# EAGLE design Y021 (EAGLE 6.6.0)

## Sheet 1 of 2
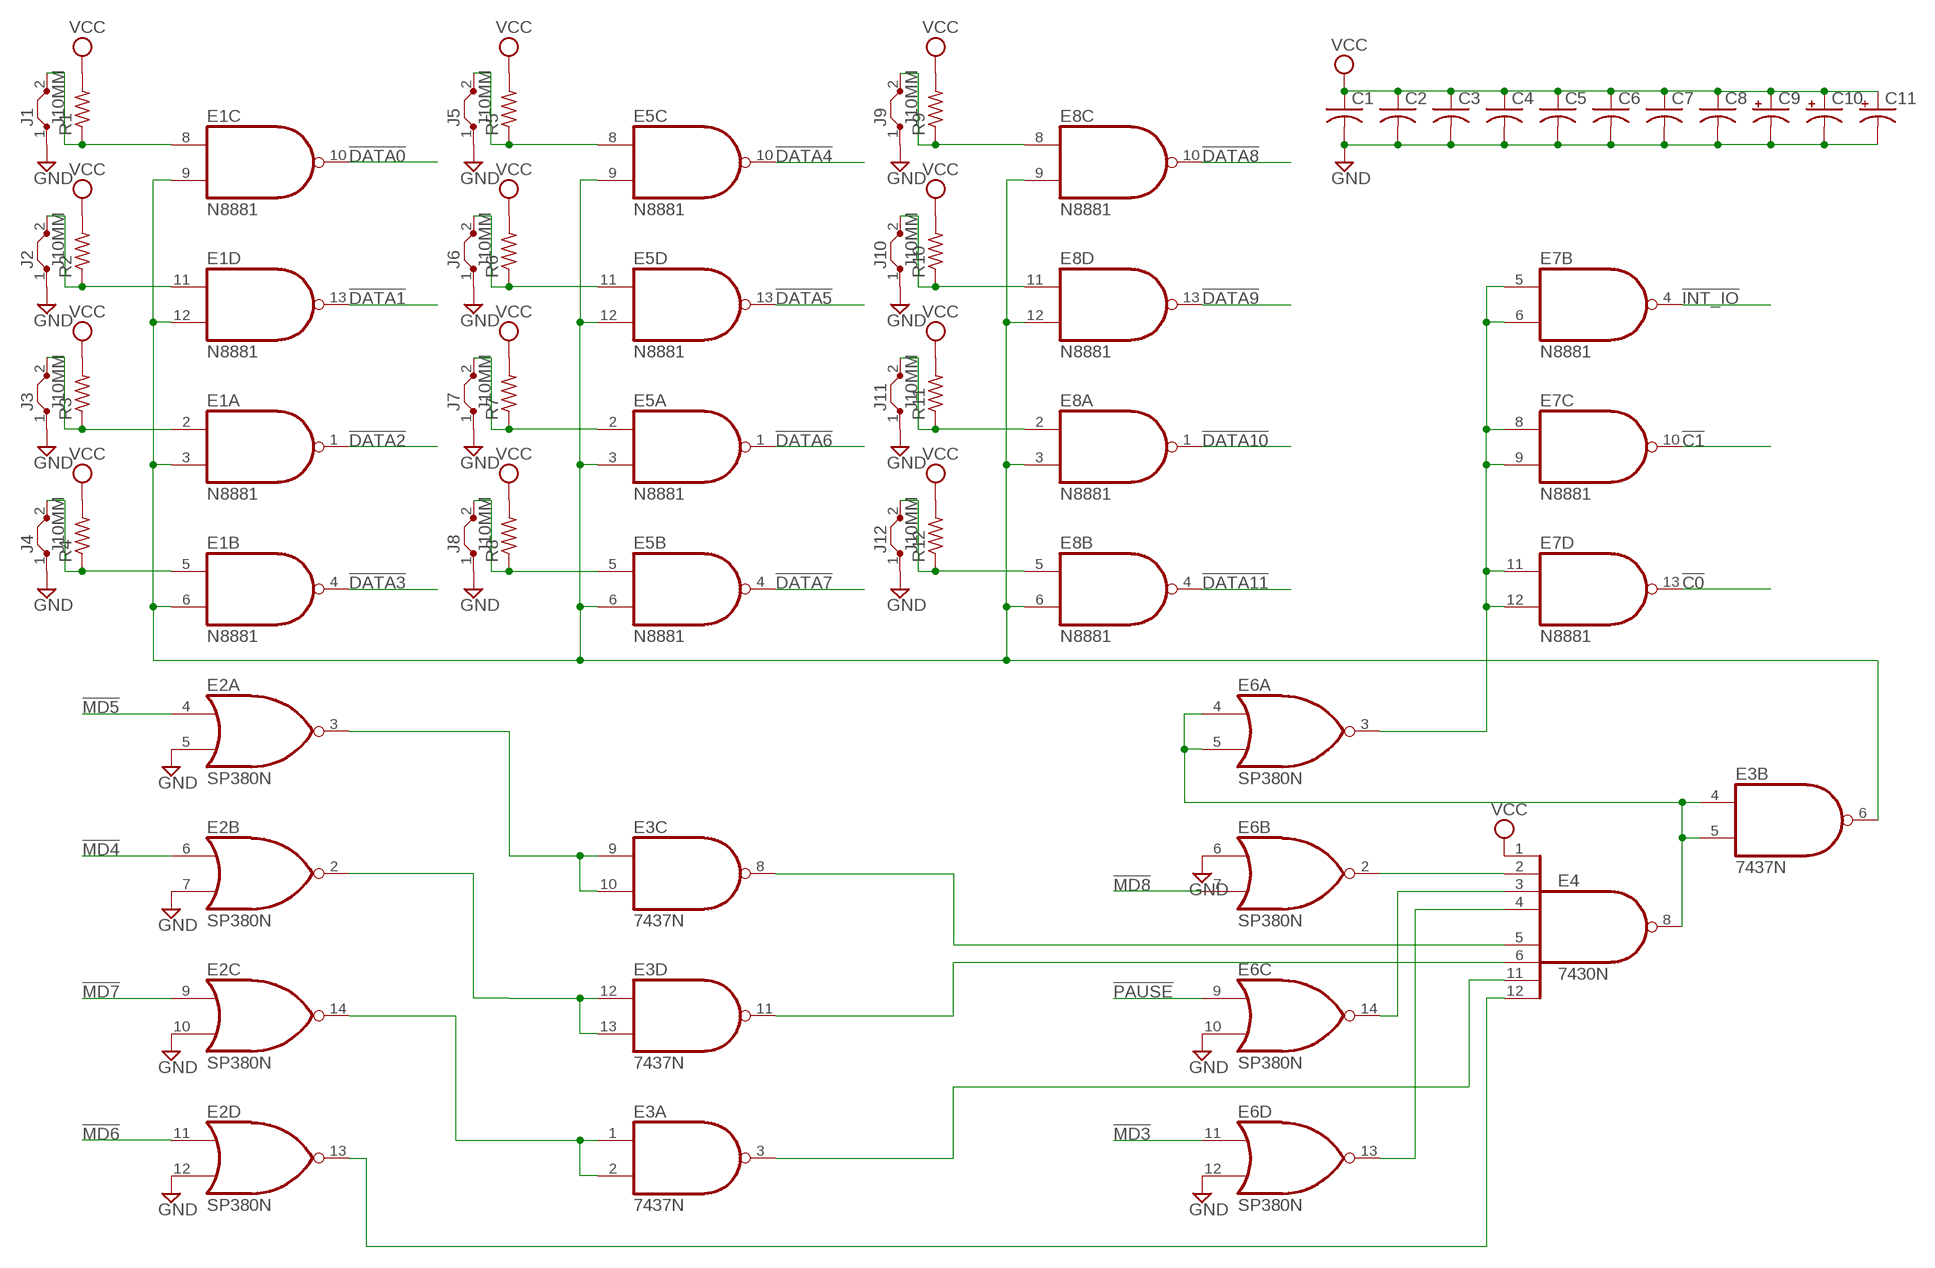
[diagram p0: schematic, sheet 1]

### Parts
C1  C-US050-025X075  [C050-025X075]
C2  C-US050-025X075  [C050-025X075]
C3  C-US050-025X075  [C050-025X075]
C4  C-US050-025X075  [C050-025X075]
C5  C-US050-025X075  [C050-025X075]
C6  C-US050-025X075  [C050-025X075]
C7  C-US050-025X075  [C050-025X075]
C8  C-US050-025X075  [C050-025X075]
C9  CPOL-USE22-6AXIAL  [E22-6]
C10  CPOL-USE22-6AXIAL  [E22-6]
C11  CPOL-USE22-6AXIAL  [E22-6]
E1  N8881  N8881N  [DIL14]
E2  SP380N  [DIL14]
E3  7437N  [DIL14]
E4  7430N  [DIL14]
E5  N8881  N8881N  [DIL14]
E6  SP380N  [DIL14]
E7  N8881  N8881N  [DIL14]
E8  N8881  N8881N  [DIL14]
J1  J10MM  [10]
J2  J10MM  [10]
J3  J10MM  [10]
J4  J10MM  [10]
J5  J10MM  [10]
J6  J10MM  [10]
J7  J10MM  [10]
J8  J10MM  [10]
J9  J10MM  [10]
J10  J10MM  [10]
J11  J10MM  [10]
J12  J10MM  [10]
R1  R-US_0207/10  [0207/10]
R2  R-US_0207/10  [0207/10]
R3  R-US_0207/10  [0207/10]
R4  R-US_0207/10  [0207/10]
R5  R-US_0207/10  [0207/10]
R6  R-US_0207/10  [0207/10]
R7  R-US_0207/10  [0207/10]
R8  R-US_0207/10  [0207/10]
R9  R-US_0207/10  [0207/10]
R10  R-US_0207/10  [0207/10]
R11  R-US_0207/10  [0207/10]
R12  R-US_0207/10  [0207/10]

### Nets
!C0: E7.13(D:O) ; also sheet 2
!C1: E7.10(C:O) ; also sheet 2
!DATA0: E1.10(C:O) ; also sheet 2
!DATA1: E1.13(D:O) ; also sheet 2
!DATA2: E1.1(A:O) ; also sheet 2
!DATA3: E1.4(B:O) ; also sheet 2
!DATA4: E5.10(C:O) ; also sheet 2
!DATA5: E5.13(D:O) ; also sheet 2
!DATA6: E5.1(A:O) ; also sheet 2
!DATA7: E5.4(B:O) ; also sheet 2
!DATA8: E8.10(C:O) ; also sheet 2
!DATA9: E8.13(D:O) ; also sheet 2
!DATA10: E8.1(A:O) ; also sheet 2
!DATA11: E8.4(B:O) ; also sheet 2
!INT_IO: E7.4(B:O) ; also sheet 2
!MD3: E6.11(D:I0) ; also sheet 2
!MD4: E2.6(B:I0) ; also sheet 2
!MD5: E2.4(A:I0) ; also sheet 2
!MD6: E2.11(D:I0) ; also sheet 2
!MD7: E2.9(C:I0) ; also sheet 2
!MD8: E6.7(B:I1) ; also sheet 2
!PAUSE: E6.9(C:I0) ; also sheet 2
GND [power]: C1.2 C2.2 C3.2 C4.2 C5.2 C6.2 C7.2 C8.2 C9.- C10.- C11.- E2.5(A:I1) E2.7(B:I1) E2.10(C:I1) E2.12(D:I1) E6.6(B:I0) E6.10(C:I1) E6.12(D:I1) J1.1 J2.1 J3.1 J4.1 J5.1 J6.1 J7.1 J8.1 J9.1 J10.1 J11.1 J12.1 ; also sheet 2
N$1: E1.2(A:I0) J3.2 R3.1
N$2: E1.3(A:I1) E1.6(B:I1) E1.9(C:I1) E1.12(D:I1) E3.6(B:O) E5.3(A:I1) E5.6(B:I1) E5.9(C:I1) E5.12(D:I1) E8.3(A:I1) E8.6(B:I1) E8.9(C:I1) E8.12(D:I1)
N$3: E1.11(D:I0) J2.2 R2.1
N$4: E6.3(A:O) E7.5(B:I0) E7.6(B:I1) E7.8(C:I0) E7.9(C:I1) E7.11(D:I0) E7.12(D:I1)
N$5: E1.8(C:I0) J1.2 R1.1
N$6: E5.2(A:I0) J7.2 R7.1
N$7: E1.5(B:I0) J4.2 R4.1
N$8: E5.8(C:I0) J5.2 R5.1
N$9: E5.11(D:I0) J6.2 R6.1
N$10: E5.5(B:I0) J8.2 R8.1
N$11: E8.8(C:I0) J9.2 R9.1
N$12: E8.5(B:I0) J12.2 R12.1
N$13: E8.2(A:I0) J11.2 R11.1
N$14: E8.11(D:I0) J10.2 R10.1
N$15: E4.2(I1) E6.2(B:O)
N$16: E4.3(I2) E6.14(C:O)
N$17: E3.4(B:I0) E3.5(B:I1) E4.8(O) E6.4(A:I0) E6.5(A:I1)
N$18: E4.4(I3) E6.13(D:O)
N$19: E3.8(C:O) E4.5(I4)
N$20: E3.11(D:O) E4.6(I5)
N$21: E2.13(D:O) E4.12(I7)
N$22: E3.3(A:O) E4.11(I6)
N$24: E2.3(A:O) E3.9(C:I0) E3.10(C:I1)
N$25: E2.2(B:O) E3.12(D:I0) E3.13(D:I1)
N$26: E2.14(C:O) E3.1(A:I0) E3.2(A:I1)
VCC [power]: C1.1 C2.1 C3.1 C4.1 C5.1 C6.1 C7.1 C8.1 C9.+ C10.+ C11.+ E4.1(I0) R1.2 R2.2 R3.2 R4.2 R5.2 R6.2 R7.2 R8.2 R9.2 R10.2 R11.2 R12.2 ; also sheet 2
Unconnected: E7.1(A:O) E7.2(A:I0) E7.3(A:I1)

## Sheet 2 of 2
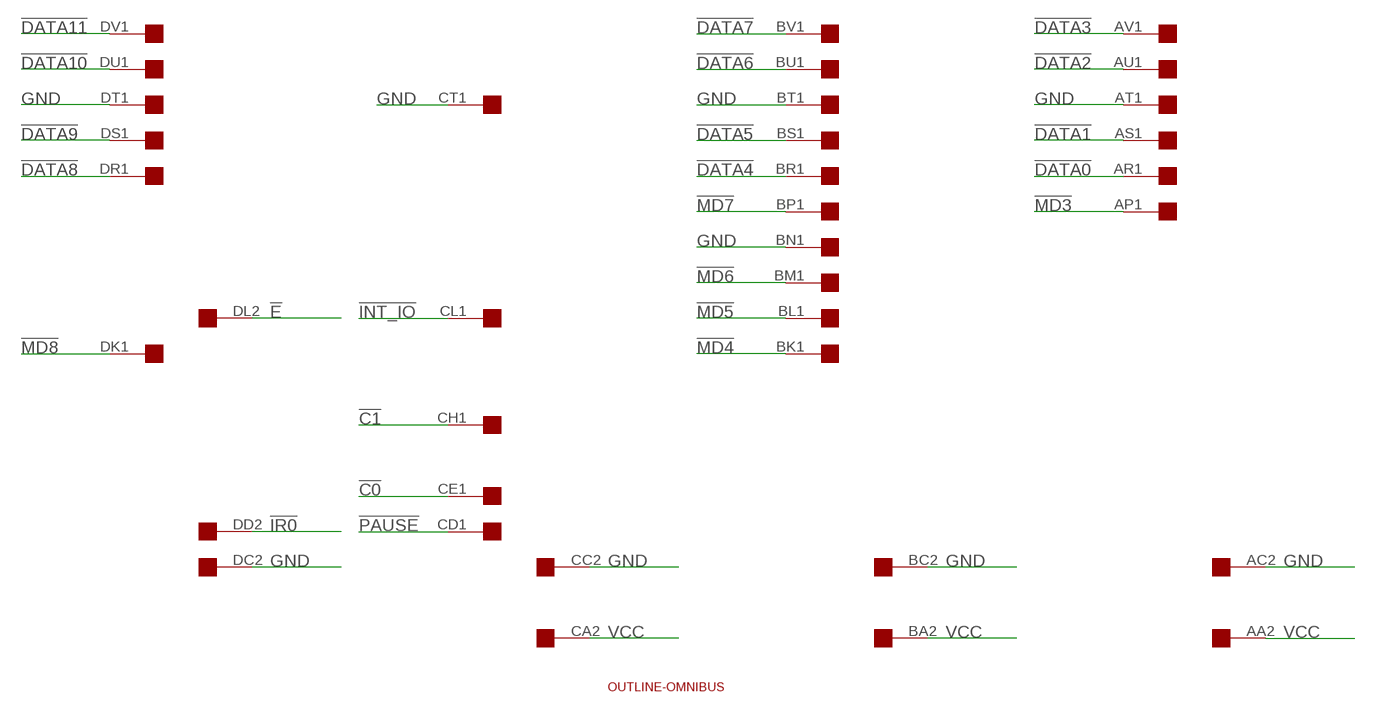
[diagram p1: schematic, sheet 2]

### Parts
U$1  OUTLINE-OMNIBUS  [OMNIBUS]
U$2  QUAD  [EDGE-CON8]

### Nets
!C0: U$2.CE1 ; also sheet 1
!C1: U$2.CH1 ; also sheet 1
!DATA0: U$2.AR1 ; also sheet 1
!DATA1: U$2.AS1 ; also sheet 1
!DATA2: U$2.AU1 ; also sheet 1
!DATA3: U$2.AV1 ; also sheet 1
!DATA4: U$2.BR1 ; also sheet 1
!DATA5: U$2.BS1 ; also sheet 1
!DATA6: U$2.BU1 ; also sheet 1
!DATA7: U$2.BV1 ; also sheet 1
!DATA8: U$2.DR1 ; also sheet 1
!DATA9: U$2.DS1 ; also sheet 1
!DATA10: U$2.DU1 ; also sheet 1
!DATA11: U$2.DV1 ; also sheet 1
!E: U$2.DL2
!INT_IO: U$2.CL1 ; also sheet 1
!IR0: U$2.DD2
!MD3: U$2.AP1 ; also sheet 1
!MD4: U$2.BK1 ; also sheet 1
!MD5: U$2.BL1 ; also sheet 1
!MD6: U$2.BM1 ; also sheet 1
!MD7: U$2.BP1 ; also sheet 1
!MD8: U$2.DK1 ; also sheet 1
!PAUSE: U$2.CD1 ; also sheet 1
GND [power]: U$2.AC2 U$2.AT1 U$2.BC2 U$2.BN1 U$2.BT1 U$2.CC2 U$2.CT1 U$2.DC2 U$2.DT1 ; also sheet 1
VCC [power]: U$2.AA2 U$2.BA2 U$2.CA2 ; also sheet 1
Unconnected: U$2.AA1 U$2.AB1 U$2.AB2 U$2.AC1 U$2.AD1 U$2.AD2 U$2.AE1 U$2.AE2 U$2.AF1 U$2.AF2 U$2.AH1 U$2.AH2 U$2.AJ1 U$2.AJ2 U$2.AK1 U$2.AK2 U$2.AL1 U$2.AL2 U$2.AM1 U$2.AM2 U$2.AN1 U$2.AN2 U$2.AP2 U$2.AR2 U$2.AS2 U$2.AT2 U$2.AU2 U$2.AV2 U$2.BA1 U$2.BB1 U$2.BB2 U$2.BC1 U$2.BD1 U$2.BD2 U$2.BE1 U$2.BE2 U$2.BF1 U$2.BF2 U$2.BH1 U$2.BH2 U$2.BJ1 U$2.BJ2 U$2.BK2 U$2.BL2 U$2.BM2 U$2.BN2 U$2.BP2 U$2.BR2 U$2.BS2 U$2.BT2 U$2.BU2 U$2.BV2 U$2.CA1 U$2.CB1 U$2.CB2 U$2.CC1 U$2.CD2 U$2.CE2 U$2.CF1 U$2.CF2 U$2.CH2 U$2.CJ1 U$2.CJ2 U$2.CK1 U$2.CK2 U$2.CL2 U$2.CM1 U$2.CM2 U$2.CN1 U$2.CN2 U$2.CP1 U$2.CP2 U$2.CR1 U$2.CR2 U$2.CS1 U$2.CS2 U$2.CT2 U$2.CU1 U$2.CU2 U$2.CV1 U$2.CV2 U$2.DA1 U$2.DA2 U$2.DB1 U$2.DB2 U$2.DC1 U$2.DD1 U$2.DE1 U$2.DE2 U$2.DF1 U$2.DF2 U$2.DH1 U$2.DH2 U$2.DJ1 U$2.DJ2 U$2.DK2 U$2.DL1 U$2.DM1 U$2.DM2 U$2.DN1 U$2.DN2 U$2.DP1 U$2.DP2 U$2.DR2 U$2.DS2 U$2.DT2 U$2.DU2 U$2.DV2

## Power pins joined to a net without a drawn wire
GND: E1.7(P:GND) E2.1(P:GND) E3.7(P:GND) E4.7(GND) E5.7(P:GND) E6.1(P:GND) E7.7(P:GND) E8.7(P:GND)
VCC: E1.14(P:VCC) E2.8(P:VCC) E3.14(P:VCC) E4.14(VCC) E5.14(P:VCC) E6.8(P:VCC) E7.14(P:VCC) E8.14(P:VCC)

## Library data of the parts
C1-C8 = rcl:C-US: CAPACITOR, American symbol
C9-C11 = rcl:CPOL-US: POLARIZED CAPACITOR, American symbol
E1 E5 E7 E8 = dec-con:N8881: Quad 2-input NAND gate, open collector
E2 E6 = dec-con:SP380: Quad NOR gate (use 8640)
E3 = 74xx-us:74*37: Quad 2-input NAND buffer
E4 = 74xx-us:74*30: 8-input NAND gate
J1-J12 = jumper:J: Bridge
R1-R12 = rcl:R-US_: RESISTOR, American symbol
U$1 = dec-con:OUTLINE-*: Board outlines for DEC boards.
U$2 = dec-con:QUAD: Quad-Height DEC board

## Net classes
1 power: width 0.635 mm

## Board
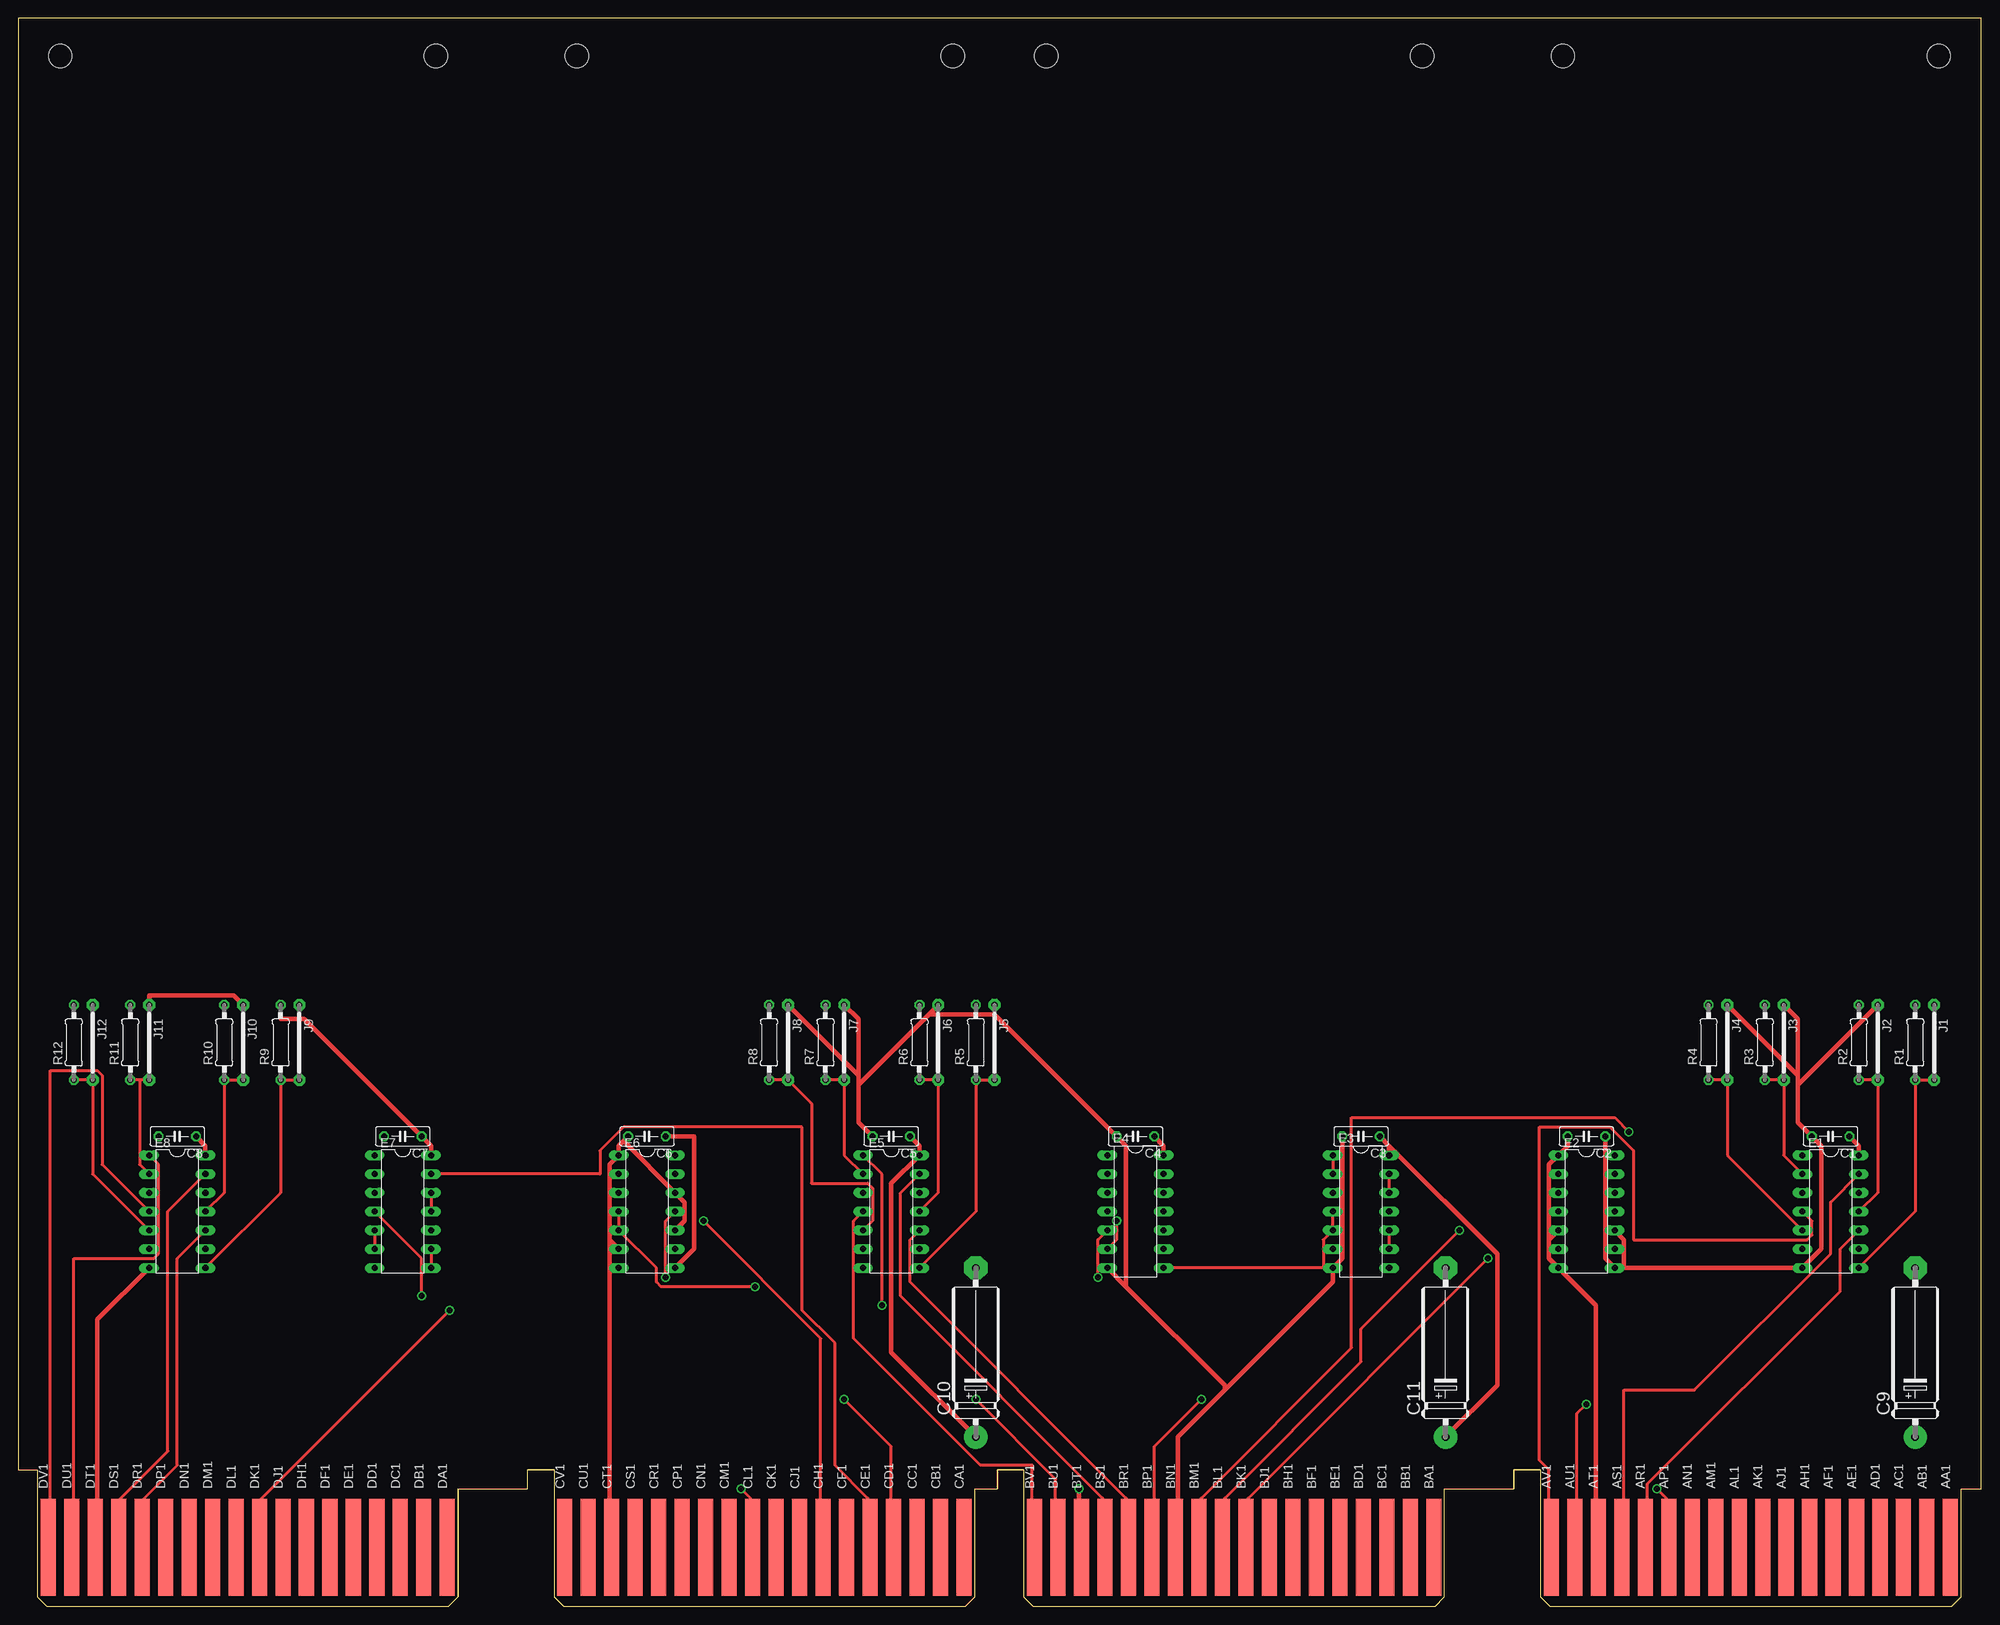
[diagram p2: board, top side]
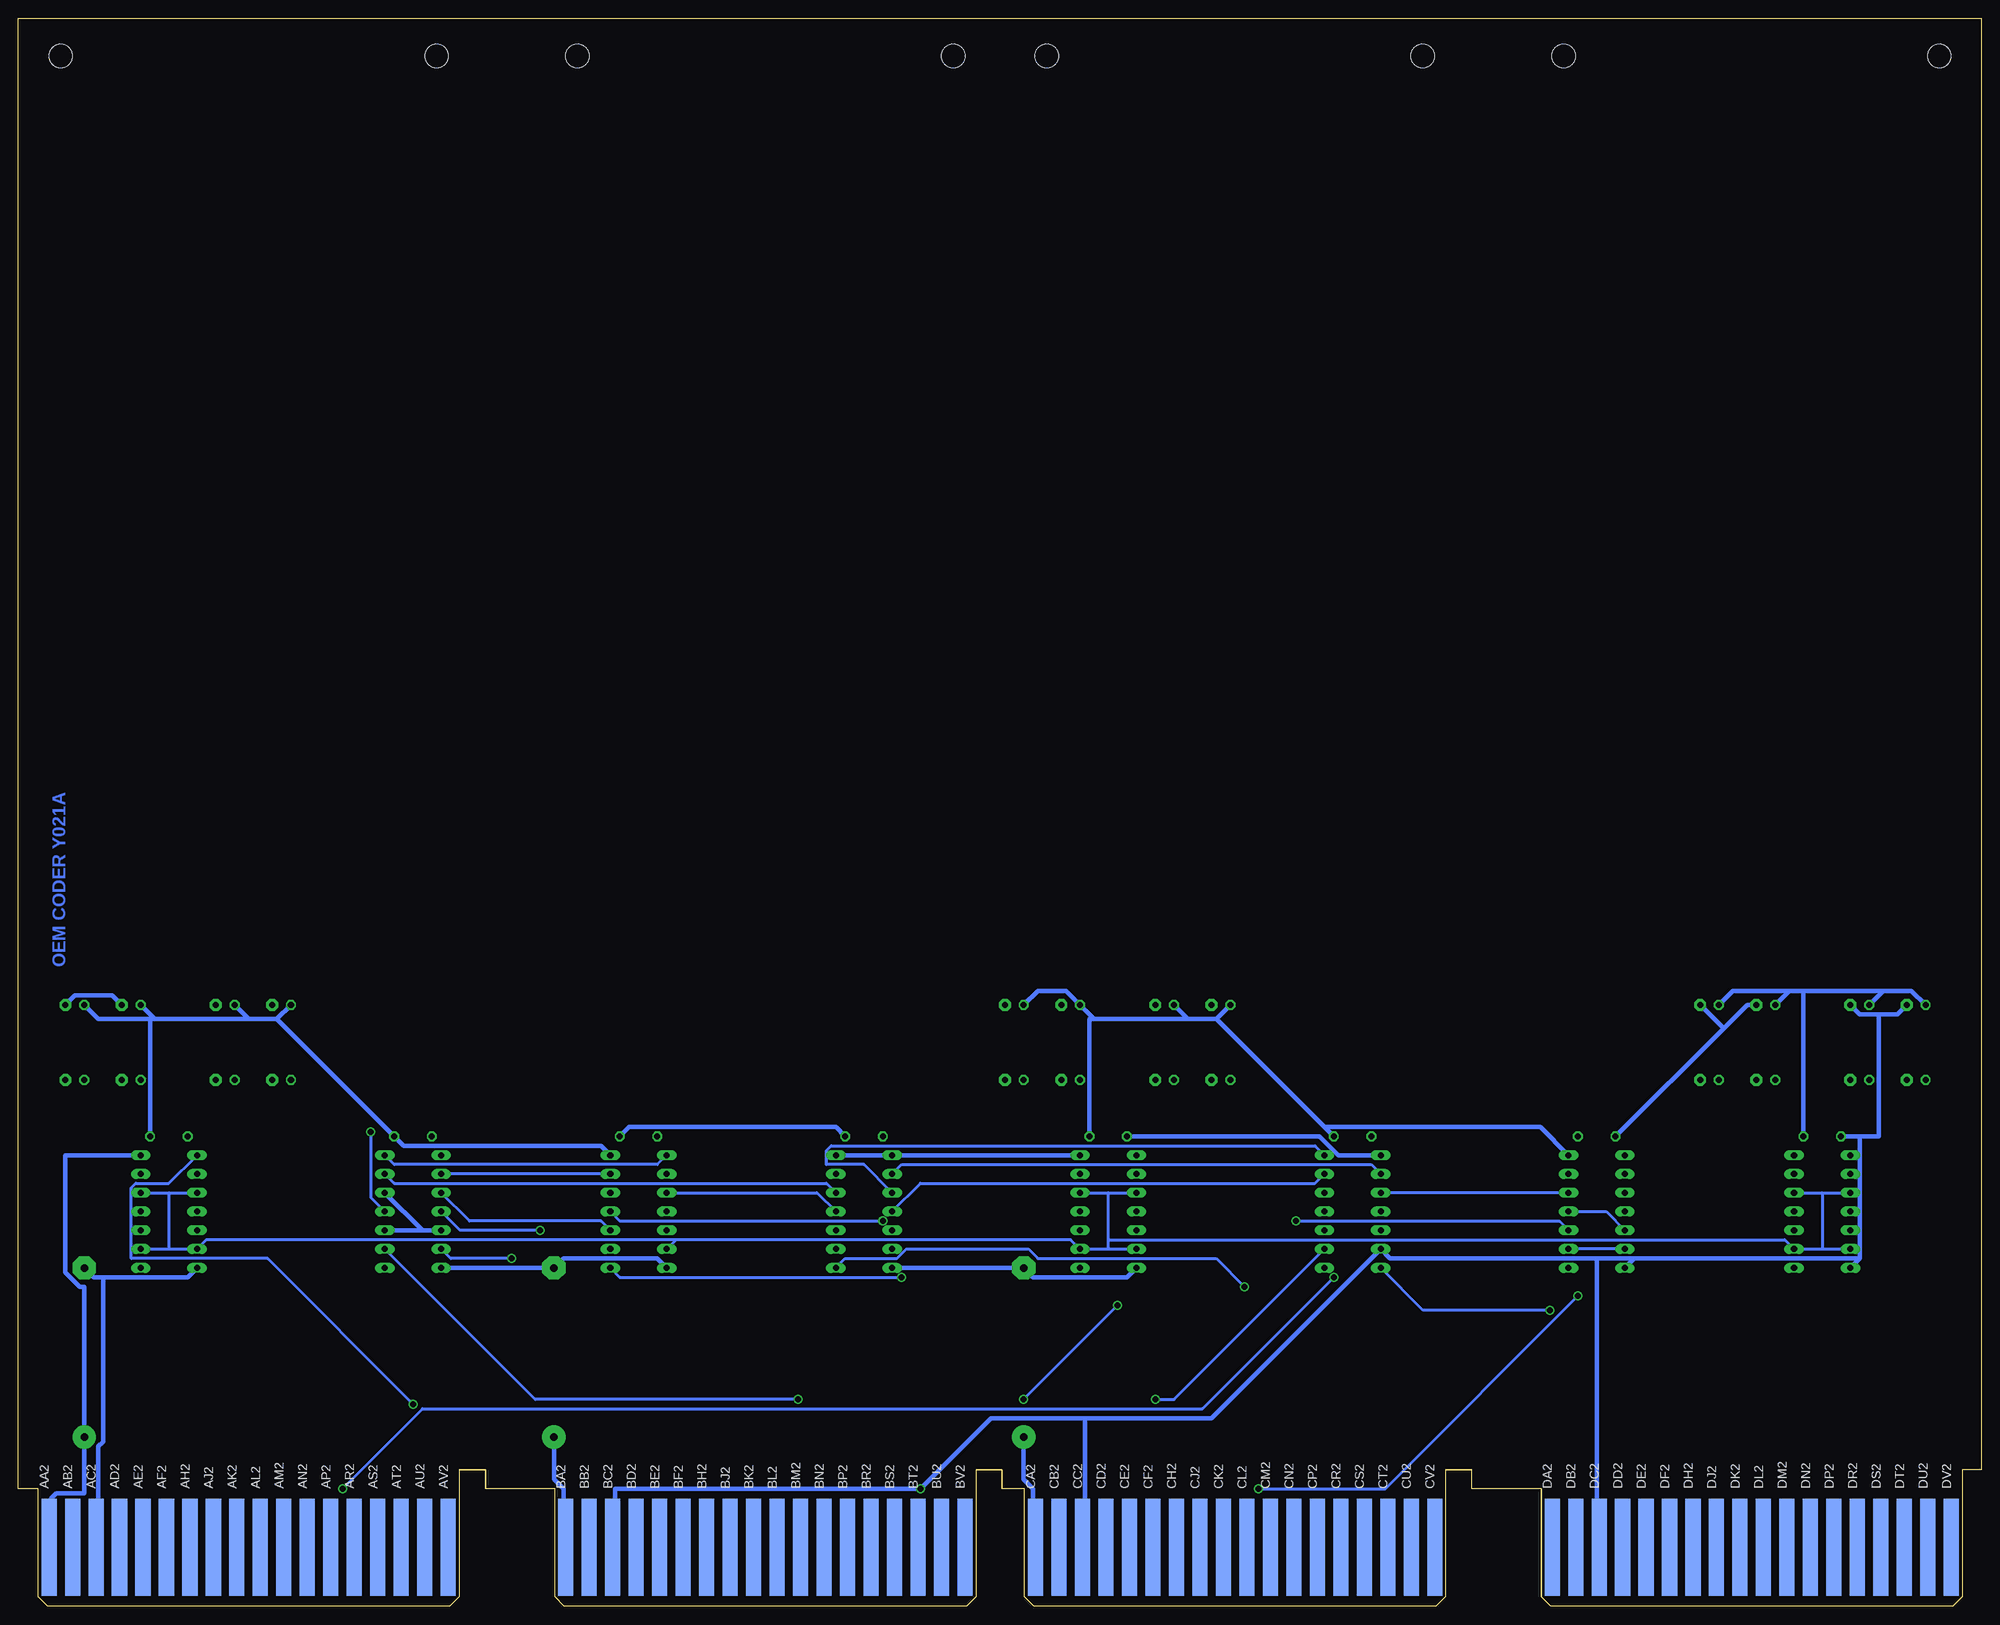
[diagram p3: board, bottom side, seen from below]

Size 265.3 x 214.63 mm. Coordinates in mm from the lower left corner, seen from the top.
Copper layers (1+16): Top 0.035mm / dielectric 1.5mm / Bottom 0.035mm
Design rules "16mils": minimum track width 16mil, minimum drill 32mil, track to track 15mil, track to pad 10mil, pad to pad 10mil, via to via 10mil, smd to smd 10mil, copper to edge 13mil, drill to drill 10mil, minimum pad ring 10mil, minimum via ring 8mil, stop-mask expansion 0mil, vias tented up to drill 0mil, thermal gap 10mil

### Footprints (pad centres in the part's own frame; a part is rotated, then mirrored left to right if it is on the bottom)
C050-025X075 = drill 0.813 octagon: 1 -2.54,0; 2 2.54,0
E22-6 = drill 1.016 pad 3.15: + -11.43,0 | drill 1.016 pad 3.15 octagon: - 11.43,0
DIL14 = drill 0.813 long: 1 -7.62,-3.81; 2 -5.08,-3.81; 3 -2.54,-3.81; 4 0,-3.81; 5 2.54,-3.81; 6 5.08,-3.81; 7 7.62,-3.81; 8 7.62,3.81; 9 5.08,3.81; 10 2.54,3.81; 11 0,3.81; 12 -2.54,3.81; 13 -5.08,3.81; 14 -7.62,3.81
10 = drill 0.813 pad 1.6 octagon: 1 -5.08,0; 2 5.08,0
0207/10 = drill 0.813 octagon: 1 -5.08,0; 2 5.08,0
OMNIBUS = hole 3.175: 208.915,209.55; 259.715,209.55; 189.865,209.55; 139.065,209.55; 75.616,209.55; 126.416,209.55; 56.566,209.55; 5.766,209.55
EDGE-CON8 = smd 2.032 x 13.106: AA1 261.303,7.938; AB1 258.127,7.938; AC1 254.952,7.938; AD1 251.778,7.938; AE1 248.602,7.938; AF1 245.428,7.938; AH1 242.252,7.938; AJ1 239.077,7.938; AK1 235.903,7.938; AL1 232.727,7.938; AM1 229.553,7.938; AN1 226.377,7.938; AP1 223.202,7.938; AR1 220.028,7.938; AS1 216.852,7.938; AT1 213.678,7.938; AU1 210.502,7.938; AV1 207.327,7.938; BA1 191.452,7.938; BB1 188.278,7.938; BC1 185.102,7.938; BD1 181.928,7.938; BE1 178.752,7.938; BF1 175.577,7.938; BH1 172.403,7.938; BJ1 169.227,7.938; BK1 166.053,7.938; BL1 162.877,7.938; BM1 159.702,7.938; BN1 156.528,7.938; BP1 153.352,7.938; BR1 150.178,7.938; BS1 147.002,7.938; BT1 143.827,7.938; BU1 140.653,7.938; BV1 137.477,7.938; CA1 127.953,7.938; CB1 124.778,7.938; CC1 121.603,7.938; CD1 118.427,7.938; CE1 115.252,7.938; CF1 112.078,7.938; CH1 108.903,7.938; CJ1 105.728,7.938; CK1 102.552,7.938; CL1 99.377,7.938; CM1 96.203,7.938; CN1 93.028,7.938; CP1 89.853,7.938; CR1 86.677,7.938; CS1 83.502,7.938; CT1 80.328,7.938; CU1 77.153,7.938; CV1 73.978,7.938; DA1 58.102,7.938; DB1 54.928,7.938; DC1 51.752,7.938; DD1 48.578,7.938; DE1 45.403,7.938; DF1 42.227,7.938; DH1 39.053,7.938; DJ1 35.877,7.938; DK1 32.703,7.938; DL1 29.527,7.938; DM1 26.352,7.938; DN1 23.177,7.938; DP1 20.003,7.938; DR1 16.828,7.938; DS1 13.652,7.938; DT1 10.477,7.938; DU1 7.303,7.938; DV1 4.128,7.938 | smd 2.032 x 13.106 bottom: AA2 261.303,7.938; AB2 258.127,7.938; AC2 254.952,7.938; AD2 251.778,7.938; AE2 248.602,7.938; AF2 245.428,7.938; AH2 242.252,7.938; AJ2 239.077,7.938; AK2 235.903,7.938; AL2 232.727,7.938; AM2 229.553,7.938; AN2 226.377,7.938; AP2 223.202,7.938; AR2 220.028,7.938; AS2 216.852,7.938; AT2 213.678,7.938; AU2 210.502,7.938; AV2 207.327,7.938; BA2 191.452,7.938; BB2 188.278,7.938; BC2 185.102,7.938; BD2 181.928,7.938; BE2 178.752,7.938; BF2 175.577,7.938; BH2 172.403,7.938; BJ2 169.227,7.938; BK2 166.053,7.938; BL2 162.877,7.938; BM2 159.702,7.938; BN2 156.528,7.938; BP2 153.352,7.938; BR2 150.178,7.938; BS2 147.002,7.938; BT2 143.827,7.938; BU2 140.653,7.938; BV2 137.477,7.938; CA2 127.953,7.938; CB2 124.778,7.938; CC2 121.603,7.938; CD2 118.427,7.938; CE2 115.252,7.938; CF2 112.078,7.938; CH2 108.903,7.938; CJ2 105.728,7.938; CK2 102.552,7.938; CL2 99.377,7.938; CM2 96.203,7.938; CN2 93.028,7.938; CP2 89.853,7.938; CR2 86.677,7.938; CS2 83.502,7.938; CT2 80.328,7.938; CU2 77.153,7.938; CV2 73.978,7.938; DA2 58.102,7.938; DB2 54.928,7.938; DC2 51.752,7.938; DD2 48.578,7.938; DE2 45.403,7.938; DF2 42.227,7.938; DH2 39.053,7.938; DJ2 35.877,7.938; DK2 32.703,7.938; DL2 29.527,7.938; DM2 26.352,7.938; DN2 23.177,7.938; DP2 20.003,7.938; DR2 16.828,7.938; DS2 13.652,7.938; DT2 10.477,7.938; DU2 7.303,7.938; DV2 4.128,7.938

### Placement (x,y rotation side)
C1  244.98,63.5 180 top
C2  211.96,63.5 180 top
C3  181.48,63.5 180 top
C4  151,63.5 180 top
C5  117.98,63.5 180 top
C6  84.96,63.5 180 top
C7  51.94,63.5 180 top
C8  21.46,63.5 180 top
C9  256.41,34.29 90 top
C10  129.41,34.29 90 top
C11  192.91,34.29 90 top
E1  244.98,53.34 270 top
E2  211.96,53.34 270 top
E3  181.48,53.34 270 top
E4  151,53.34 270 top
E5  117.98,53.34 270 top
E6  84.96,53.34 270 top
E7  51.94,53.34 270 top
E8  21.46,53.34 270 top
J1  258.95,76.2 270 top
J2  251.33,76.2 270 top
J3  238.63,76.2 270 top
J4  231.01,76.2 270 top
J5  131.95,76.2 270 top
J6  124.33,76.2 270 top
J7  111.63,76.2 270 top
J8  104.01,76.2 270 top
J9  37.97,76.2 270 top
J10  30.35,76.2 270 top
J11  17.65,76.2 270 top
J12  10.03,76.2 270 top
R1  256.41,76.2 90 top
R2  248.79,76.2 90 top
R3  236.09,76.2 90 top
R4  228.47,76.2 90 top
R5  129.41,76.2 90 top
R6  121.79,76.2 90 top
R7  109.09,76.2 90 top
R8  101.47,76.2 90 top
R9  35.43,76.2 90 top
R10  27.81,76.2 90 top
R11  15.11,76.2 90 top
R12  7.49,76.2 90 top
U$1  -0.13,0 0 top
U$2  -0.13,0 0 top

### Tracks (layer width: path | path; a pad name or v marks a point on that pad's centre or on a via)
!C0
  Top 0.406: E7.13 78.61,58.42 78.61,61.59 81.79,64.77 105.92,64.77 105.92,40.01 110.36,35.56 110.36,19.05 114.81,14.61 114.81,8.26 U$2.CE1
!C1  (via drill 0.81)
  Top 0.406: v92.58,52.07 108.46,36.2 108.46,8.26 U$2.CH1
  Bottom 0.406: E7.10 57.02,52.07 v92.58,52.07
!DATA0
  Top 0.406: E1.10 246.25,48.26 246.25,42.55 220.22,16.51 220.22,8.26 U$2.AR1
!DATA1
  Top 0.406: E1.13 244.98,54.61 244.98,47.62 226.57,29.21 217.04,29.21 217.04,8.26 U$2.AS1
!DATA2  (via drill 0.81)
  Top 0.406: v211.96,27.3 210.69,26.04 210.69,8.26 U$2.AU1
  Bottom 0.406: E1.1 244.98,57.15 249.43,57.15 250.06,56.52 250.06,46.99 231.65,46.99 v211.96,27.3
!DATA3
  Top 0.406: E1.4 242.44,52.07 242.44,50.16 241.81,49.53 218.31,49.53 218.31,61.59 215.14,64.77 205.61,64.77 205.61,19.68 206.88,18.41 206.88,8.26 U$2.AV1
!DATA4
  Top 0.406: E5.10 120.52,49.53 120.52,43.81 149.73,14.61 149.73,8.26 U$2.BR1
!DATA5
  Top 0.406: E5.13 119.25,55.88 119.25,41.91 146.56,14.61 146.56,8.26 U$2.BS1
!DATA6  (via drill 0.81)
  Top 0.406: E5.1 116.71,58.42 v116.71,40.64 | v129.41,27.94 140.21,17.14 140.21,8.26 U$2.BU1
  Bottom 0.406: v129.41,27.94 v116.71,40.64
!DATA7
  Top 0.406: E5.4 112.9,52.07 112.9,36.2 130.05,19.05 137.03,19.05 137.03,8.26 U$2.BV1
!DATA8
  Top 0.406: E8.10 21.46,46.99 21.46,19.05 17.02,14.61 17.02,8.26 U$2.DR1
!DATA9
  Top 0.406: E8.13 20.19,53.34 20.19,20.95 13.84,14.61 13.84,8.26 U$2.DS1
!DATA10
  Top 0.406: E8.1 18.92,59.69 18.92,47.62 18.29,46.99 7.49,46.99 7.49,8.26 U$2.DU1
!DATA11
  Top 0.406: E8.4 11.3,59.69 11.3,71.75 10.67,72.39 4.32,72.39 4.32,8.26 U$2.DV1
!INT_IO  (via drill 0.81)
  Top 0.406: E7.4 54.48,46.99 v54.48,41.91 | v97.66,15.88 98.93,14.61 98.93,8.26 U$2.CL1
  Bottom 0.406: v54.48,41.91 80.52,15.88 v97.66,15.88
!MD3  (via drill 0.81)
  Top 0.406: E6.11 87.5,52.07 v87.5,44.45 | v221.49,15.88 222.76,14.61 222.76,8.26 U$2.AP1
  Bottom 0.406: v87.5,44.45 105.28,26.67 210.69,26.67 v221.49,15.88
!MD4  (via drill 0.81)
  Top 0.406: v198.63,46.99 166.24,14.61 166.24,8.26 U$2.BK1
  Bottom 0.406: E2.6 206.88,46.99 v198.63,46.99
!MD5  (via drill 0.81)
  Top 0.406: v194.82,50.8 181.48,37.47 181.48,33.02 163.07,14.61 163.07,8.26 U$2.BL1
  Bottom 0.406: E2.4 205.61,50.8 v194.82,50.8
!MD6  (via drill 0.81)
  Top 0.406: v217.68,64.14 215.77,66.04 180.21,66.04 180.21,34.92 159.89,14.61 159.89,8.26 U$2.BM1
  Bottom 0.406: E2.11 217.68,55.24 v217.68,64.14
!MD7  (via drill 0.81)
  Top 0.406: v159.89,27.94 153.54,21.59 153.54,8.26 U$2.BP1
  Bottom 0.406: E2.9 195.45,27.94 v159.89,27.94
!MD8  (via drill 0.81)
  Top 0.406: v58.29,40.01 32.89,14.61 32.89,8.26 U$2.DK1
  Bottom 0.406: E6.7 75.44,40.01 v58.29,40.01
!PAUSE  (via drill 0.81)
  Top 0.406: v111.63,27.94 117.98,21.59 117.98,8.26 U$2.CD1
  Bottom 0.406: E6.9 109.09,27.94 v111.63,27.94
GND  (via drill 0.81)
  Top 0.635: 240.54,71.75 240.54,79.38 J3.1 | 240.54,71.75 240.54,70.48 | 240.54,70.48 240.54,65.41 C1.2 243.71,62.23 243.71,48.26 E1.7 217.04,45.72 217.04,49.53 E2.10 | 240.54,71.75 J4.1 | 240.54,70.48 J2.1 | 131.95,80.01 C4.2 149.73,62.23 149.73,43.18 | J5.1 131.95,80.01 | C5.2 113.54,65.41 113.54,70.48 | 113.54,71.75 113.54,79.38 J7.1 | 113.54,71.75 113.54,70.48 | 113.54,71.75 J8.1 | 113.54,70.48 123.06,80.01 | 123.06,80.01 J6.1 | 123.06,80.01 131.95,80.01 | C3.2 178.94,46.99 E3.7 177.67,43.81 163.07,29.21 | C2.2 209.42,62.23 E2.1 206.88,59.69 206.88,49.53 | 206.88,49.53 206.88,46.99 E2.7 213.23,40.64 213.23,8.26 U$2.AT1 | E2.5 206.88,49.53 | 163.07,29.21 156.72,22.86 156.72,8.26 U$2.BN1 | 149.73,43.18 163.07,29.84 163.07,29.21 | 149.73,43.18 E4.7 | E6.10 90.04,52.07 90.04,54.61 E6.12 81.79,62.87 | 79.88,49.53 E6.6 | 79.88,49.53 79.88,59.69 E6.1 81.15,62.23 81.79,62.87 | 81.79,62.87 C6.2 | E8.7 10.67,38.73 10.67,8.26 U$2.DT1 | 79.88,49.53 79.88,8.26 U$2.CT1 | v143.38,15.88 143.38,8.26 U$2.BT1 | J10.1 29.08,82.55 17.65,82.55 J11.1
  Bottom 0.635: E1.7 242.44,44.45 253.87,44.45 | 253.87,44.45 255.14,44.45 C9.- | J1.1 257.68,82.55 252.6,82.55 J2.1 | 253.87,44.45 253.87,22.23 254.51,21.59 254.51,8.26 U$2.AC2 | E5.7 115.44,44.45 128.14,44.45 C10.- E4.7 | E2.5 210.69,50.8 | 210.69,50.8 E2.10 | 210.69,50.8 E2.12 | E2.7 C11.- 191.64,46.99 178.94,46.99 E3.7 | 34.8,78.11 31.62,81.28 J10.1 | 34.8,78.11 C7.2 | 34.8,78.11 J9.1 | J12.1 11.3,80.01 13.84,80.01 | 13.84,80.01 16.38,80.01 J11.1 | 16.38,46.99 E8.7 | 16.38,63.5 16.38,46.99 | C8.2 16.38,63.5 | 46.86,46.99 E7.7 | 16.38,46.99 46.86,46.99 | 13.84,80.01 13.84,63.5 16.38,63.5 | 46.86,46.99 51.94,46.99 | 51.94,46.99 79.88,46.99 E6.6 104.01,25.4 121.16,25.4 | 51.94,46.99 51.94,8.26 U$2.DC2 | 121.16,25.4 121.16,8.26 U$2.CC2 | 121.16,25.4 133.86,25.4 v143.38,15.88 184.66,15.88 184.66,8.26 U$2.BC2 | C5.2 89.41,63.5 86.87,60.96 E6.1
N$1
  Top 0.406: E1.2 238.63,60.96 J3.2 R3.1
N$2
  Bottom 0.406: E1.9 244.98,48.26 | 244.98,48.26 E1.6 239.9,49.53 176.4,49.53 | E1.12 244.98,55.88 | 244.98,55.88 E1.3 | 244.98,55.88 244.98,48.26 | 21.46,48.26 E8.9 26.54,49.53 117.98,49.53 | 21.46,48.26 E8.6 | E8.12 21.46,55.88 | 21.46,55.88 E8.3 | 21.46,55.88 21.46,48.26 | E5.12 117.98,55.88 | 117.98,55.88 E5.3 | 117.98,48.26 E5.9 123.06,49.53 176.4,49.53 | 117.98,48.26 E5.6 | 176.4,49.53 E3.6 | 117.98,48.26 117.98,49.53 | 117.98,49.53 117.98,55.88
N$3
  Top 0.406: E1.11 251.33,55.88 J2.2 R2.1
N$4
  Top 0.406: E7.9 E7.8 | E7.5 E7.6 | E7.12 E7.11
  Bottom 0.406: E7.6 E7.9 | E7.12 E6.3 | E7.5 50.67,53.34 E7.11
N$5
  Top 0.406: E1.8 256.41,53.34 R1.1 J1.2
N$6
  Top 0.406: E5.2 111.63,60.96 J7.2 R7.1
N$7
  Top 0.406: E1.5 231.01,60.96 J4.2 R4.1
N$8
  Top 0.406: E5.8 129.41,53.34 R5.1 J5.2
N$9
  Top 0.406: E5.11 124.33,55.88 J6.2 R6.1
N$10
  Top 0.406: E5.5 115.44,52.07 115.44,56.52 114.81,57.15 107.19,57.15 107.19,67.94 J8.2 R8.1
N$11
  Top 0.406: E8.8 35.43,55.88 R9.1 J9.2
N$12
  Top 0.406: E8.5 10.03,58.42 J12.2 R12.1
N$13
  Top 0.406: J11.2 16.38,71.12 | 16.38,71.12 R11.1 | E8.2 16.38,59.69 16.38,71.12
N$14
  Top 0.406: E8.11 27.81,55.88 R10.1 J10.2
N$15
  Bottom 0.406: E6.2 82.42,59.69 145.92,59.69 E4.2
N$16
  Bottom 0.406: E6.14 90.04,62.23 155.45,62.23 156.08,61.59 156.08,59.69 151,59.69 E4.3
N$17  (via drill 0.81)
  Top 0.406: E6.4 E6.5 86.23,45.72 86.23,43.81 86.87,43.18 v99.57,43.18 | E4.8 176.4,45.72 176.4,49.53 E3.5 E3.4
  Bottom 0.406: v99.57,43.18 103.38,46.99 127.51,46.99 128.78,48.26 145.29,48.26 146.56,46.99 153.54,46.99 E4.8
N$18
  Bottom 0.406: E6.13 90.04,57.15 143.38,57.15 E4.4
N$19  (via drill 0.81)
  Top 0.406: E4.5 145.92,49.53 v145.92,44.45
  Bottom 0.406: v145.92,44.45 184.02,44.45 E3.8
N$20  (via drill 0.81)
  Top 0.406: E4.6 148.46,49.53 v148.46,52.07
  Bottom 0.406: v148.46,52.07 184.02,52.07 E3.11
N$21
  Bottom 0.406: E4.12 156.08,57.15 214.5,57.15 E2.13
N$22
  Bottom 0.406: E4.11 157.35,55.88 E3.3
N$24
  Top 0.406: E3.10 E3.9
  Bottom 0.406: E2.3 204.34,52.07 186.56,52.07 E3.10
N$25
  Top 0.406: E3.13 E3.12
  Bottom 0.406: E3.13 E2.2
N$26
  Top 0.406: E3.1 E3.2
  Bottom 0.406: E2.14 214.5,59.69 178.94,59.69 E3.1
VCC
  Top 0.635: 185.29,62.23 C3.1 | E3.14 185.29,62.23 | E2.8 214.5,46.99 C2.1 | C11.+ 199.9,29.84 199.9,47.62 185.29,62.23 | C1.1 248.79,62.23 E1.14 | E7.14 55.75,62.23 C7.1 38.61,79.38 35.43,79.38 R9.2 | C8.1 25.27,62.23 E8.14 | C6.1 91.31,63.5 91.31,48.26 E6.8 | C4.1 154.81,62.23 E4.14 | C5.1 121.79,62.23 E5.14 117.98,57.15 117.98,34.29 C10.+
  Bottom 0.635: C11.+ 192.91,17.14 191.64,15.88 191.64,8.26 U$2.BA2 | E3.14 186.56,62.23 213.23,62.23 C2.1 230.38,79.38 | U$2.AA2 260.86,8.26 260.86,14.61 260.22,15.24 256.41,15.24 C9.+ 256.41,43.18 257.05,43.18 258.95,45.09 258.95,60.96 E1.14 | 230.38,79.38 R4.2 | 234.19,79.38 230.38,79.38 | R3.2 234.19,79.38 | 246.89,79.38 R2.2 | 234.19,79.38 246.89,79.38 | R1.2 254.51,79.38 247.52,79.38 | 246.89,79.38 247.52,79.38 | 247.52,79.38 C1.1 | R12.2 9.4,83.19 13.21,83.19 | R11.2 13.21,83.19 | 25.91,83.19 R10.2 | 13.21,83.19 24,83.19 | 24,83.19 25.91,83.19 | R9.2 33.53,83.19 25.91,83.19 | 24,83.19 C8.1 | C10.+ 129.41,17.14 128.14,15.88 128.14,8.26 U$2.CA2 | E4.14 E4.1 E5.14 | 103.38,79.38 R8.2 | 107.19,79.38 103.38,79.38 | R7.2 107.19,79.38 | 119.89,79.38 R6.2 123.7,83.19 127.51,83.19 R5.2 | 107.19,79.38 119.89,79.38 | C5.1 120.52,79.38 119.89,79.38 | 103.38,79.38 88.77,64.77 | 88.77,64.77 C6.1 | E7.14 59.56,64.77 88.77,64.77 | C3.1 182.75,64.77 154.81,64.77 C4.1

### Text on the board
Bottom: OEM CODER Y021A